# Altium project Backlight.PrjPcb
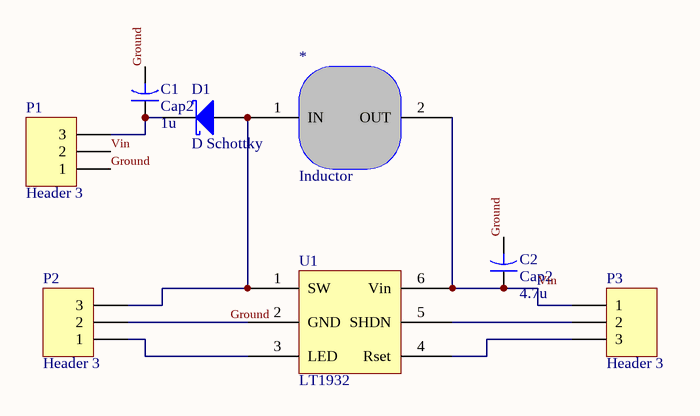
[diagram p0: Backlight.SchDoc]
1 sheet, 8 parts. Net scope: global (net labels, ports and power ports of the same name join across sheets).
Board file: Backlight.PcbDoc

## Sheet Backlight.SchDoc
size Letter

### Parts
*  Inductor  [Inductor]
C1  Cap2  value 1u  [CAPR5-4X5]
C2  Cap2  value 4.7u  [CAPR5-4X5]
D1  D Schottky  [RAD-0.2]
P1  Header 3  [HDR1X3]
P2  Header 3  [HDR1X3]
P3  Header 3  [HDR1X3]
U1  LT1932  [SOT6]

### Nets
Ground: C1.2 C2.2 P1.1 P2.2 U1.2(GND)
Vin: *.2(OUT) C2.1 P1.2 P3.1 U1.6(Vin)
Net*_1: *.1(IN) D1.1(A) P2.3 U1.1(SW)
NetC1_1: C1.1 D1.2(K) P1.3
NetP2_1: P2.1 U1.3(LED)
NetP3_2: P3.2 U1.5(SHDN)
NetP3_3: P3.3 U1.4(Rset)

### Library data of the parts
C1 C2 = Cap2: Capacitor; Published: 23-Sep-2002; PackageReference: CAPR5-4X5; Publisher: Altium Limited; PackageDescription: Capacitor; 2 Leads
D1 = D Schottky: Schottky Diode; Published: 8-Jun-2000; LatestRevisionDate: 17-Jul-2002; LatestRevisionNote: Re-released for DXP Platform.; PackageReference: SMB; Publisher: Altium Limited; PackageDescription: DO-214-AA/SMB; 2 C-Bend Leads; Body 5.3 x 3.6 mm, inc. leads (LxW); Code_JEDEC: DO-214-AA
P1-P3 = Header 3: Header, 3-Pin; LatestRevisionDate: 17-Jul-2002; LatestRevisionNote: Re-released for DXP Platform.; Publisher: Altium Limited